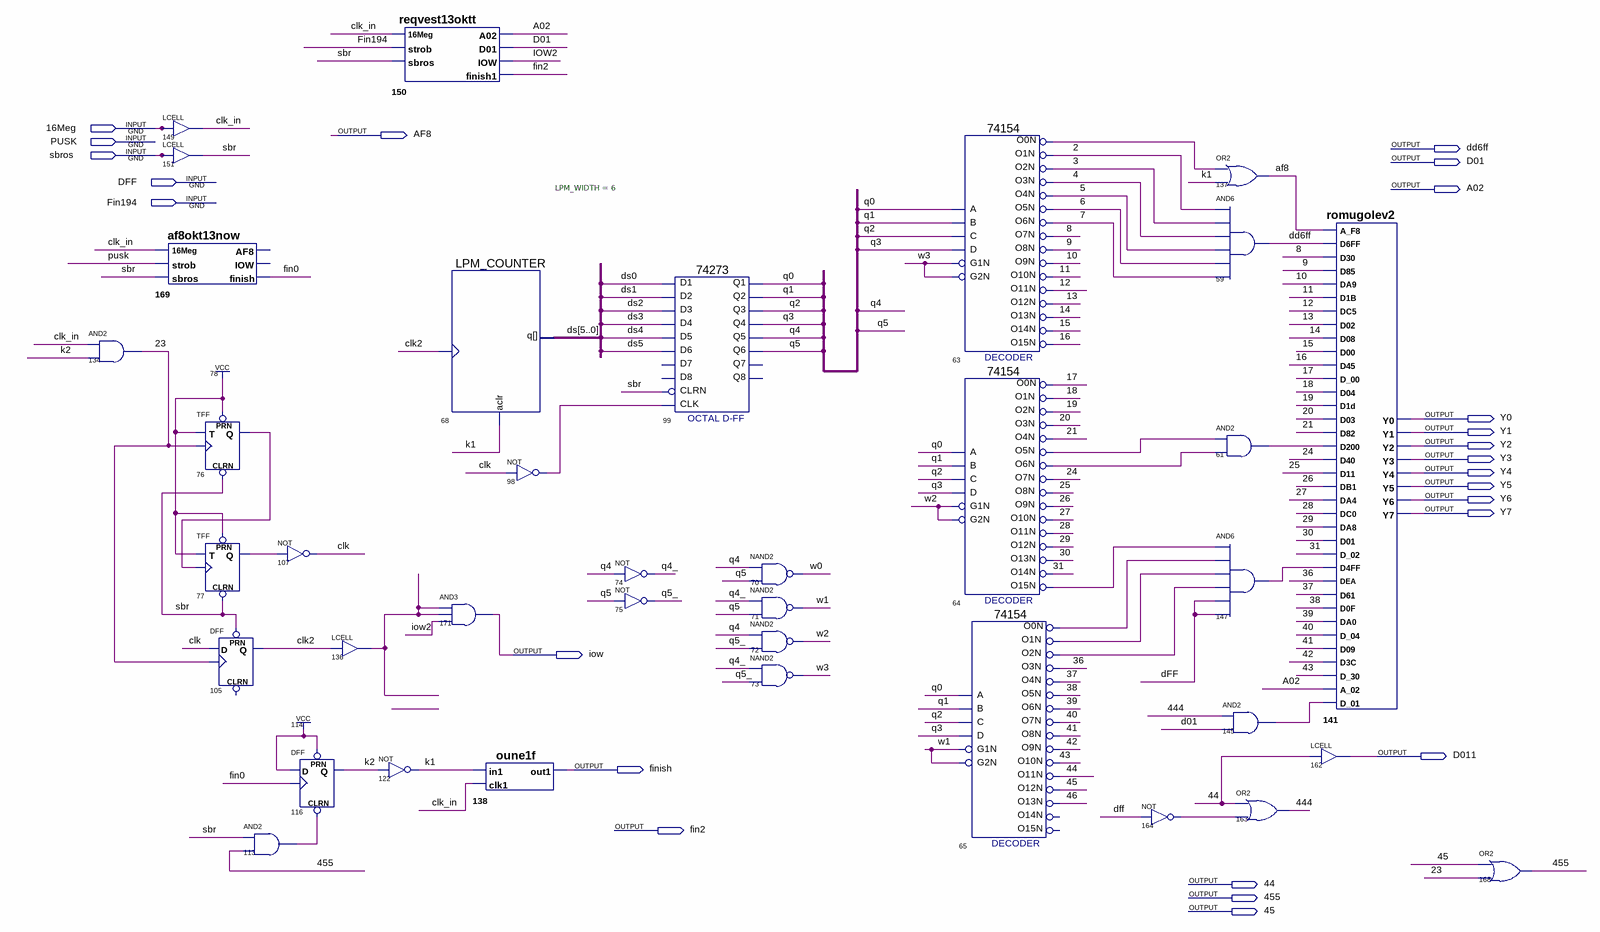
[diagram p0: schematic sheet]
// Quartus schematic header5okt_2016.bdf as structural Verilog: 37 symbols, 24 pins
module header5okt_2016 (
  input  \16Meg ,
  input  PUSK,
  input  sbros,
  input  DFF,
  input  Fin194,
  output AF8,
  output dd6ff,
  output D01,
  output A02,
  output Y0,
  output Y1,
  output Y2,
  output Y3,
  output Y4,
  output Y5,
  output Y6,
  output Y7,
  output iow,
  output D011,
  output finish,
  output fin2,
  output \44 ,
  output \455 ,
  output \45 
);

  wire \2 , \3 , \4 , \5 , \6 , \7 , \8 , \9 , \10 , \11 , \12 , \13 , \14 , \15 , \16 , \17 , \18 , \19 ,
       \20 , \21 , \23 , \24 , \25 , \26 , \27 , \28 , \29 , \30 , \31 , \36 , \37 , \38 , \39 , \40 , \41 ,
       \42 , \43 , \46 , \444 , clk, clk2, clk_in, fin0, iow2, k1, k2, n61_out, n63_o0n, n64_o5n, n64_o6n,
       n64_o15n, n65_o0n, n65_o1n, n65_o2n, n76_q, n77_q, n98_out, n113_out, n136_out, n145_out, n147_out,
       n164_out, q0, q1, q2, q3, q4, q4_, q5, q5_, sbr, w0, w1, w2, w3;
  wire [5:0] ds;

  and u_134 (\23 , clk_in, k2);
  LCELL u_149 (.IN(\16Meg ), .OUT(clk_in));
  LCELL u_151 (.IN(sbros), .OUT(sbr));
  af8okt13now u_169 (.\16Meg (clk_in), .strob(PUSK), .sbros(sbr), .finish(fin0));  // open: AF8, IOW
  TFF u_76 (.PRN(1'b1), .CLRN(sbr), .T(1'b1), .CLK(\23 ), .Q(n76_q));
  TFF u_77 (.PRN(1'b1), .CLRN(sbr), .T(1'b1), .CLK(n76_q), .Q(n77_q));
  DFF u_105 (.CLK(\23 ), .D(clk), .PRN(sbr), .Q(clk2));  // open: CLRN
  and u_113 (n113_out, sbr, \455 );
  not u_107 (clk, n77_q);
  DFF u_116 (.CLRN(n113_out), .CLK(fin0), .D(1'b1), .PRN(1'b1), .Q(k2));
  LCELL u_136 (.IN(clk2), .OUT(n136_out));
  reqvest13oktt u_150 (.\16Meg (clk_in), .strob(Fin194), .sbros(sbr), .A02(A02), .D01(D01), .IOW(iow2), .finish1(fin2));
  not u_122 (k1, k2);
  LPM_COUNTER #(.LPM_WIDTH(6)) u_68 (.clock(clk2), .aclr(k1), .q(ds));
  and u_171 (iow, n136_out, n136_out, iow2);
  oune1f u_138 (.in1(k1), .clk1(clk_in), .out1(finish));
  not u_98 (n98_out, clk);
  not u_74 (q4_, q4);
  not u_75 (q5_, q5);
  \74273  u_99 (
    .D1(ds[0]), .D2(ds[1]), .D3(ds[2]), .D4(ds[3]), .D5(ds[4]), .D6(ds[5]), .CLK(n98_out), .CLRN(sbr),
    .Q1(q0), .Q2(q1), .Q3(q2), .Q4(q3), .Q5(q4), .Q6(q5));  // open: D7, D8, Q7, Q8
  nand u_70 (w0, q4, q5);
  nand u_71 (w1, q4_, q5);
  nand u_72 (w2, q4, q5_);
  nand u_73 (w3, q4_, q5_);
  \74154  u_63 (
    .D(q3), .C(q2), .B(q1), .A(q0), .G2N(w3), .G1N(w3), .O0N(n63_o0n), .O12N(\13 ), .O11N(\12 ), .O10N(\11 ),
    .O15N(\16 ), .O14N(\15 ), .O13N(\14 ), .O1N(\2 ), .O2N(\3 ), .O3N(\4 ), .O4N(\5 ), .O5N(\6 ), .O6N(\7 ),
    .O7N(\8 ), .O8N(\9 ), .O9N(\10 ));
  \74154  u_64 (
    .D(q3), .C(q2), .B(q1), .A(q0), .G2N(w2), .G1N(w2), .O0N(\17 ), .O12N(\29 ), .O11N(\28 ), .O10N(\27 ),
    .O15N(n64_o15n), .O14N(\31 ), .O13N(\30 ), .O1N(\18 ), .O2N(\19 ), .O3N(\20 ), .O4N(\21 ), .O5N(n64_o5n),
    .O6N(n64_o6n), .O7N(\24 ), .O8N(\25 ), .O9N(\26 ));
  \74154  u_65 (
    .D(q3), .C(q2), .B(q1), .A(q0), .G2N(w1), .G1N(w1), .O0N(n65_o0n), .O12N(\45 ), .O11N(\44 ), .O10N(\43 ),
    .O13N(\46 ), .O1N(n65_o1n), .O2N(n65_o2n), .O3N(\36 ), .O4N(\37 ), .O5N(\38 ), .O6N(\39 ), .O7N(\40 ),
    .O8N(\41 ), .O9N(\42 ));  // open: O15N, O14N
  not u_164 (n164_out, DFF);
  or u_137 (AF8, n63_o0n, k1);
  and u_59 (dd6ff, \2 , \3 , \4 , \5 , \6 , \7 );
  and u_61 (n61_out, n64_o5n, n64_o6n);
  and u_147 (n147_out, n64_o15n, n65_o0n, n65_o1n, n65_o2n, DFF, DFF);
  and u_145 (n145_out, \444 , D01);
  or u_163 (\444 , \44 , n164_out);
  romugolev2 u_141 (
    .A_F8(AF8), .D6FF(dd6ff), .D30(\8 ), .D85(\9 ), .DA9(\10 ), .D1B(\11 ), .DC5(\12 ), .D02(\13 ),
    .D08(\14 ), .D00(\15 ), .D45(\16 ), .D_00(\17 ), .D04(\18 ), .D1d(\19 ), .D03(\20 ), .D82(\21 ),
    .D200(n61_out), .D40(\24 ), .D11(\25 ), .DB1(\26 ), .DA4(\27 ), .DC0(\28 ), .DA8(\29 ), .D01(\30 ),
    .D_02(\31 ), .D4FF(n147_out), .DEA(\36 ), .D61(\37 ), .D0F(\38 ), .DA0(\39 ), .D_04(\40 ), .D09(\41 ),
    .D3C(\42 ), .D_30(\43 ), .A_02(A02), .D_01(n145_out), .Y0(Y0), .Y1(Y1), .Y2(Y2), .Y3(Y3), .Y4(Y4),
    .Y5(Y5), .Y6(Y6), .Y7(Y7));
  LCELL u_162 (.IN(\44 ), .OUT(D011));
  or u_168 (\455 , \45 , \23 );
endmodule
